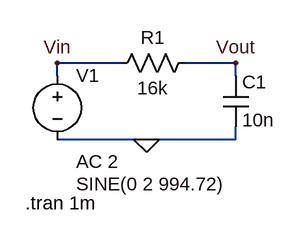
[diagram p0: schematic Low pass filter - Copy.asc]
Low pass filter - Copy.asc, the LTspice schematic file:
Version 4
SHEET 1 880 680
WIRE 208 96 128 96
WIRE 352 96 288 96
WIRE 128 112 128 96
WIRE 352 112 352 96
WIRE 240 192 128 192
WIRE 352 192 352 176
WIRE 352 192 240 192
FLAG 240 192 0
FLAG 352 96 Vout
FLAG 128 96 Vin
SYMBOL voltage 128 96 R0
WINDOW 123 24 124 Left 2
WINDOW 39 0 0 Left 0
WINDOW 3 24 152 Left 2
SYMATTR Value2 AC 2
SYMATTR InstName V1
SYMATTR Value SINE(0 2 994.72)
SYMBOL res 304 80 R90
WINDOW 0 0 56 VBottom 2
WINDOW 3 32 56 VTop 2
SYMATTR InstName R1
SYMATTR Value 16k
SYMBOL cap 336 112 R0
SYMATTR InstName C1
SYMATTR Value 10n
TEXT 88 272 Left 2 !.tran 1m

The netlist it stands for:
* Low pass filter - Copy.asc
V1 Vin 0 SINE(0 2 994.72) AC 2
R1 Vout Vin 16k
C1 Vout 0 10n
.tran 1m
.backanno
.end